# EAGLE schematic coilcube (EAGLE 6.3)

## Sheet 1 of 5: EPIC & Programmer
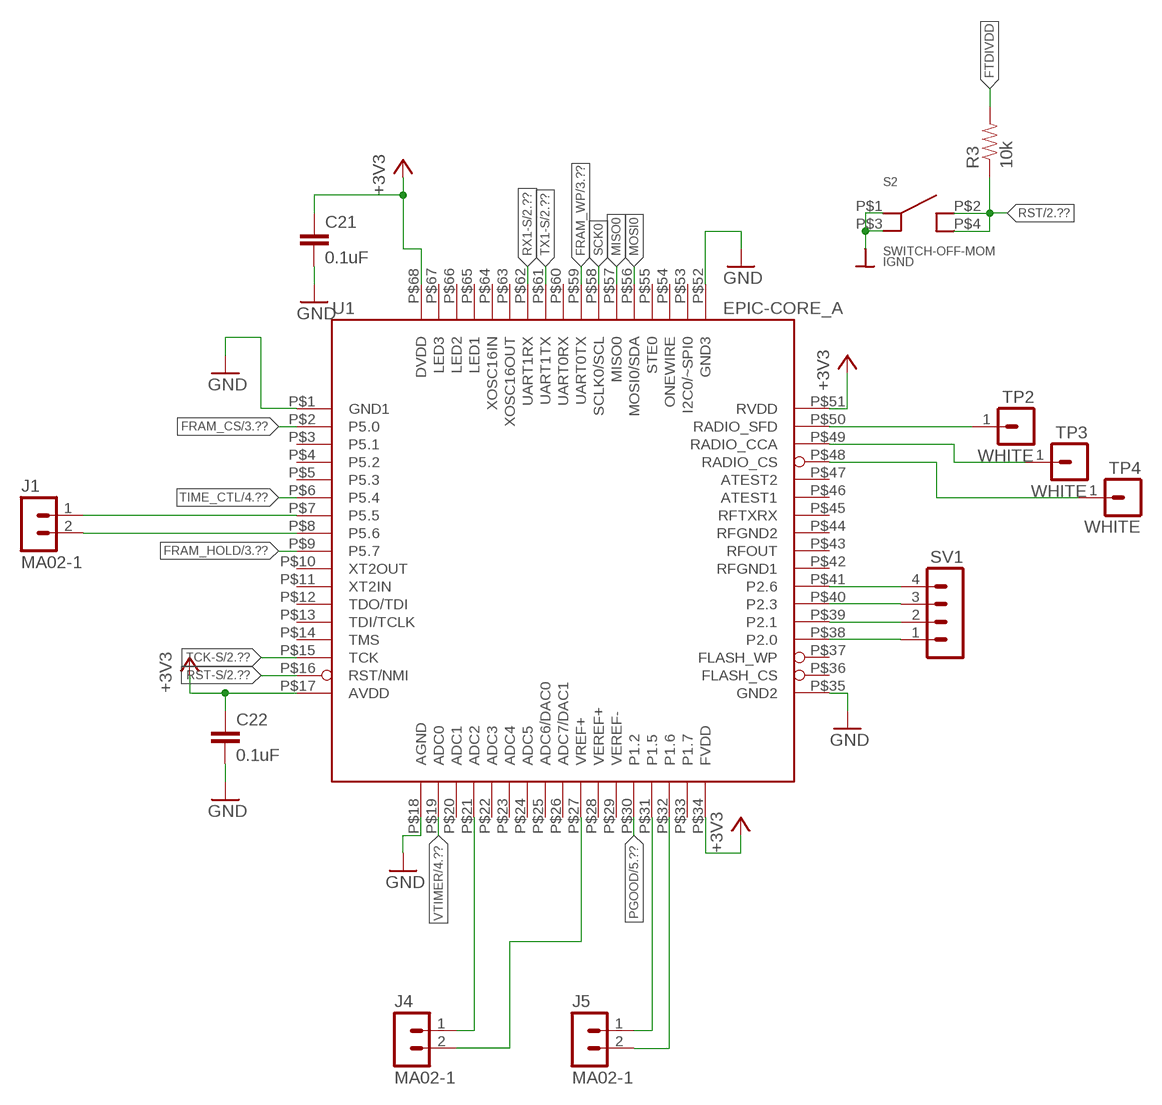
[diagram p0: schematic, sheet 1]

### Parts
C21  0.1uF  C-EUC0603  [C0603]
C22  0.1uF  C-EUC0603  [C0603]
J1  MA02-1  [MA02-1]
J4  MA02-1  [MA02-1]
J5  MA02-1  [MA02-1]
R3  10k  RESISTOR0603-RES  [0603-RES]
S2  SWITCH-OFF-MOM  [SWITCH-OFF-MOM]
SV1  MA04-1  [MA04-1]
TP2  WHITE  MA01-1  [MA01-1]
TP3  WHITE  MA01-1  [MA01-1]
TP4  WHITE  MA01-1  [MA01-1]
U1  EPIC-CORE_A  [EPIC-LCC68]

### Nets
+3V3: C21.1 C22.1 U1.P$17(AVDD) U1.P$34(FVDD) U1.P$51(RVDD) U1.P$68(DVDD) ; also sheet 2,3,4,5
FRAM_CS: U1.P$2(P5.0) ; also sheet 3
FRAM_HOLD: U1.P$9(P5.7) ; also sheet 3
FRAM_WP: U1.P$59(UART0TX) ; also sheet 3
FTDIVDD: R3.2 ; also sheet 2
GND: C21.2 C22.2 U1.P$1(GND1) U1.P$18(AGND) U1.P$35(GND2) U1.P$52(GND3) ; also sheet 2,3,4,5
IGND: S2.P$1(P1) S2.P$3(P3) ; also sheet 2
MISO0: U1.P$57(MISO0) ; also sheet 3
MOSI0: U1.P$56(MOSI0/SDA) ; also sheet 3
N$2: J5.1 U1.P$31(P1.5)
N$3: J5.2 U1.P$32(P1.6)
N$4: J4.1 U1.P$21(ADC2)
N$5: J4.2 U1.P$27(VREF+)
N$6: SV1.4 U1.P$41(P2.6)
N$7: SV1.3 U1.P$40(P2.3)
N$8: SV1.2 U1.P$39(P2.1)
N$9: SV1.1 U1.P$38(P2.0)
N$10: TP2.1 U1.P$50(RADIO_SFD)
N$13: TP3.1 U1.P$49(RADIO_CCA)
N$14: TP4.1 U1.P$48(RADIO_CS)
N$26: J1.1 U1.P$7(P5.5)
N$27: J1.2 U1.P$8(P5.6)
PGOOD: U1.P$30(P1.2) ; also sheet 5
RST: R3.1 S2.P$2(P2) S2.P$4(P4) ; also sheet 2
RST-S: U1.P$16(RST/NMI) ; also sheet 2
RX1-S: U1.P$62(UART1RX) ; also sheet 2
SCK0: U1.P$58(SCLK0/SCL) ; also sheet 3
TCK-S: U1.P$15(TCK) ; also sheet 2
TIME_CTL: U1.P$6(P5.4) ; also sheet 4
TX1-S: U1.P$61(UART1TX) ; also sheet 2
VTIMER: U1.P$19(ADC0) ; also sheet 4
Unconnected: U1.P$3(P5.1) U1.P$4(P5.2) U1.P$5(P5.3) U1.P$10(XT2OUT) U1.P$11(XT2IN) U1.P$12(TDO/TDI) U1.P$13(TDI/TCLK) U1.P$14(TMS) U1.P$20(ADC1) U1.P$22(ADC3) U1.P$23(ADC4) U1.P$24(ADC5) U1.P$25(ADC6/DAC0) U1.P$26(ADC7/DAC1) U1.P$28(VEREF+) U1.P$29(VEREF-) U1.P$33(P1.7) U1.P$36(FLASH_CS) U1.P$37(FLASH_WP) U1.P$42(RFGND1) U1.P$43(RFOUT) U1.P$44(RFGND2) U1.P$45(RFTXRX) U1.P$46(ATEST1) U1.P$47(ATEST2) U1.P$53(I2C0/~SPI0) U1.P$54(ONEWIRE) U1.P$55(STE0) U1.P$60(UART0RX) U1.P$63(XOSC16OUT) U1.P$64(XOSC16IN) U1.P$65(LED1) U1.P$66(LED2) U1.P$67(LED3)

## Sheet 2 of 5: Programmer
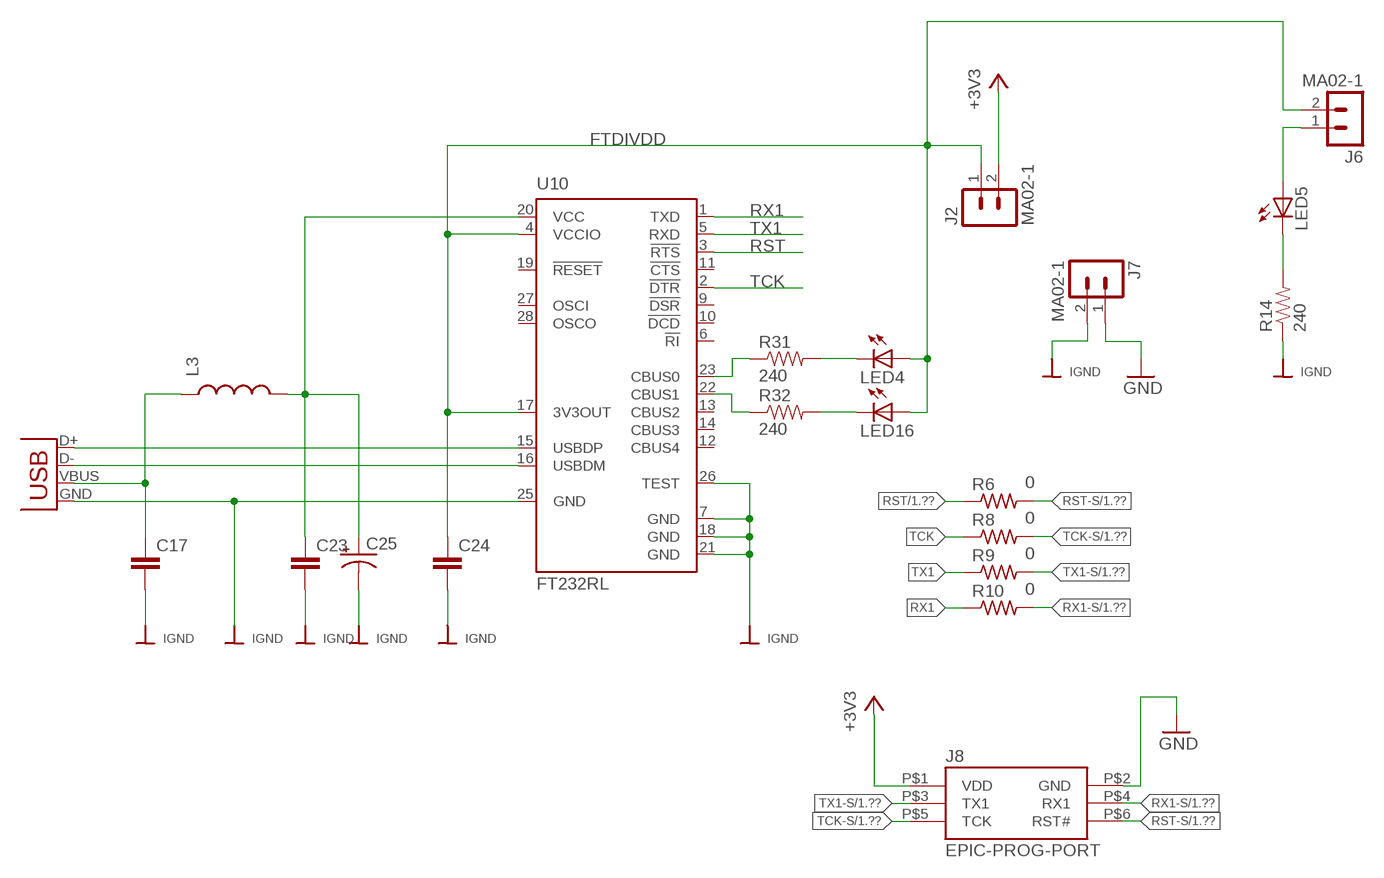
[diagram p1: schematic, sheet 2]

### Parts
C17  CAP0603-CAP  [0603-CAP]
C23  CAP0603-CAP  [0603-CAP]
C24  CAP0603-CAP  [0603-CAP]
C25  CAP_POL1206  [EIA3216]
J2  MA02-1  [MA02-1]
J6  MA02-1  [MA02-1]
J7  MA02-1  [MA02-1]
J8  EPIC-PROG-PORT  [HEADER2X3X2MM]
L3  INDUCTOR0603  [0603]
LED4  LED0603  [LED-0603]
LED5  LED0603  [LED-0603]
LED16  LED0603  [LED-0603]
R6  0  R-US_R0603  [R0603]
R8  0  R-US_R0603  [R0603]
R9  0  R-US_R0603  [R0603]
R10  0  R-US_R0603  [R0603]
R14  240  RESISTOR0603-RES  [0603-RES]
R31  240  RESISTOR0603-RES  [0603-RES]
R32  240  RESISTOR0603-RES  [0603-RES]
U10  FT232RL  [SSOP28]
X2  USBSMD  [USB-MINIB]

### Nets
+3V3: J2.2 J8.P$1(VDD) ; also sheet 1,3,4,5
FTDIVDD: C24.1 J2.1 J6.2 LED4.A LED16.A U10.4(VCCIO) U10.17(3V3OUT) ; also sheet 1
GND: J7.1 J8.P$2(GND) ; also sheet 1,3,4,5
IGND: C17.2 C23.2 C24.2 C25.C(-) J7.2 R14.1 U10.7(GND) U10.18(GND) U10.21(GND) U10.25(GND) U10.26(TEST) X2.GND ; also sheet 1
N$11: J6.1 LED5.A
N$32: LED5.C R14.2
N$38: U10.15(USBDP) X2.D+
N$39: U10.16(USBDM) X2.D-
N$40: LED4.C R31.2
N$41: LED16.C R32.2
N$42: R31.1 U10.23(CBUS0)
N$43: R32.1 U10.22(CBUS1)
RST: R6.1 U10.3(!RTS) ; also sheet 1
RST-S: J8.P$6(RST#) R6.2 ; also sheet 1
RX1: R10.1 U10.1(TXD)
RX1-S: J8.P$4(RX1) R10.2 ; also sheet 1
TCK: R8.1 U10.2(!DTR)
TCK-S: J8.P$5(TCK) R8.2 ; also sheet 1
TX1: R9.1 U10.5(RXD)
TX1-S: J8.P$3(TX1) R9.2 ; also sheet 1
USBVCC1: C23.1 C25.A(+) L3.2 U10.20(VCC)
VBUS1: C17.1 L3.1 X2.VBUS
Unconnected: U10.6(!RI) U10.9(!DSR) U10.10(!DCD) U10.11(!CTS) U10.12(CBUS4) U10.13(CBUS2) U10.14(CBUS3) U10.19(!RESET) U10.27(OSCI) U10.28(OSCO)

## Sheet 3 of 5: FRAM
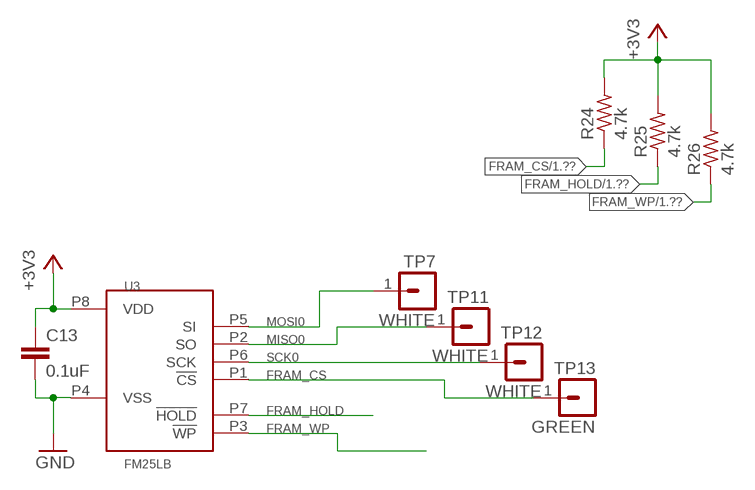
[diagram p2: schematic, sheet 3]

### Parts
C13  0.1uF  C-EUC0603  [C0603]
R24  4.7k  R-US_R0603  [R0603]
R25  4.7k  R-US_R0603  [R0603]
R26  4.7k  R-US_R0603  [R0603]
TP7  WHITE  MA01-1  [MA01-1]
TP11  WHITE  MA01-1  [MA01-1]
TP12  WHITE  MA01-1  [MA01-1]
TP13  GREEN  MA01-1  [MA01-1]
U3  FM25LB  [SOIC_8]

### Nets
+3V3: C13.1 R24.2 R25.2 R26.2 U3.P8(VDD) ; also sheet 1,2,4,5
FRAM_CS: R24.1 TP13.1 U3.P1(!CS) ; also sheet 1
FRAM_HOLD: R25.1 U3.P7(!HOLD) ; also sheet 1
FRAM_WP: R26.1 U3.P3(!WP) ; also sheet 1
GND: C13.2 U3.P4(VSS) ; also sheet 1,2,4,5
MISO0: TP11.1 U3.P2(SO) ; also sheet 1
MOSI0: TP7.1 U3.P5(SI) ; also sheet 1
SCK0: TP12.1 U3.P6(SCK) ; also sheet 1

## Sheet 4 of 5: Time Keeping
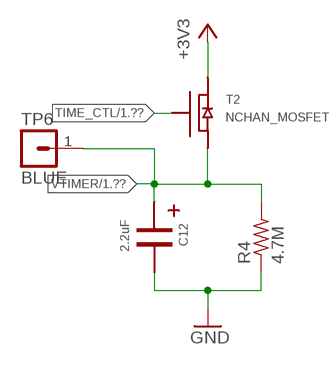
[diagram p3: schematic, sheet 4]

### Parts
C12  2.2uF  CAP_POLEA1MM5  [CPOL_EEA_1MM5]
R4  4.7M  R-US_R0805  [R0805]
T2  NCHAN_MOSFET  [NCHAN_MOSFET]
TP6  BLUE  MA01-1  [MA01-1]

### Nets
+3V3: T2.D ; also sheet 1,2,3,5
GND: C12.- R4.1 ; also sheet 1,2,3,5
TIME_CTL: T2.G ; also sheet 1
VTIMER: C12.+ R4.2 T2.S TP6.1 ; also sheet 1

## Sheet 5 of 5: Power Supply
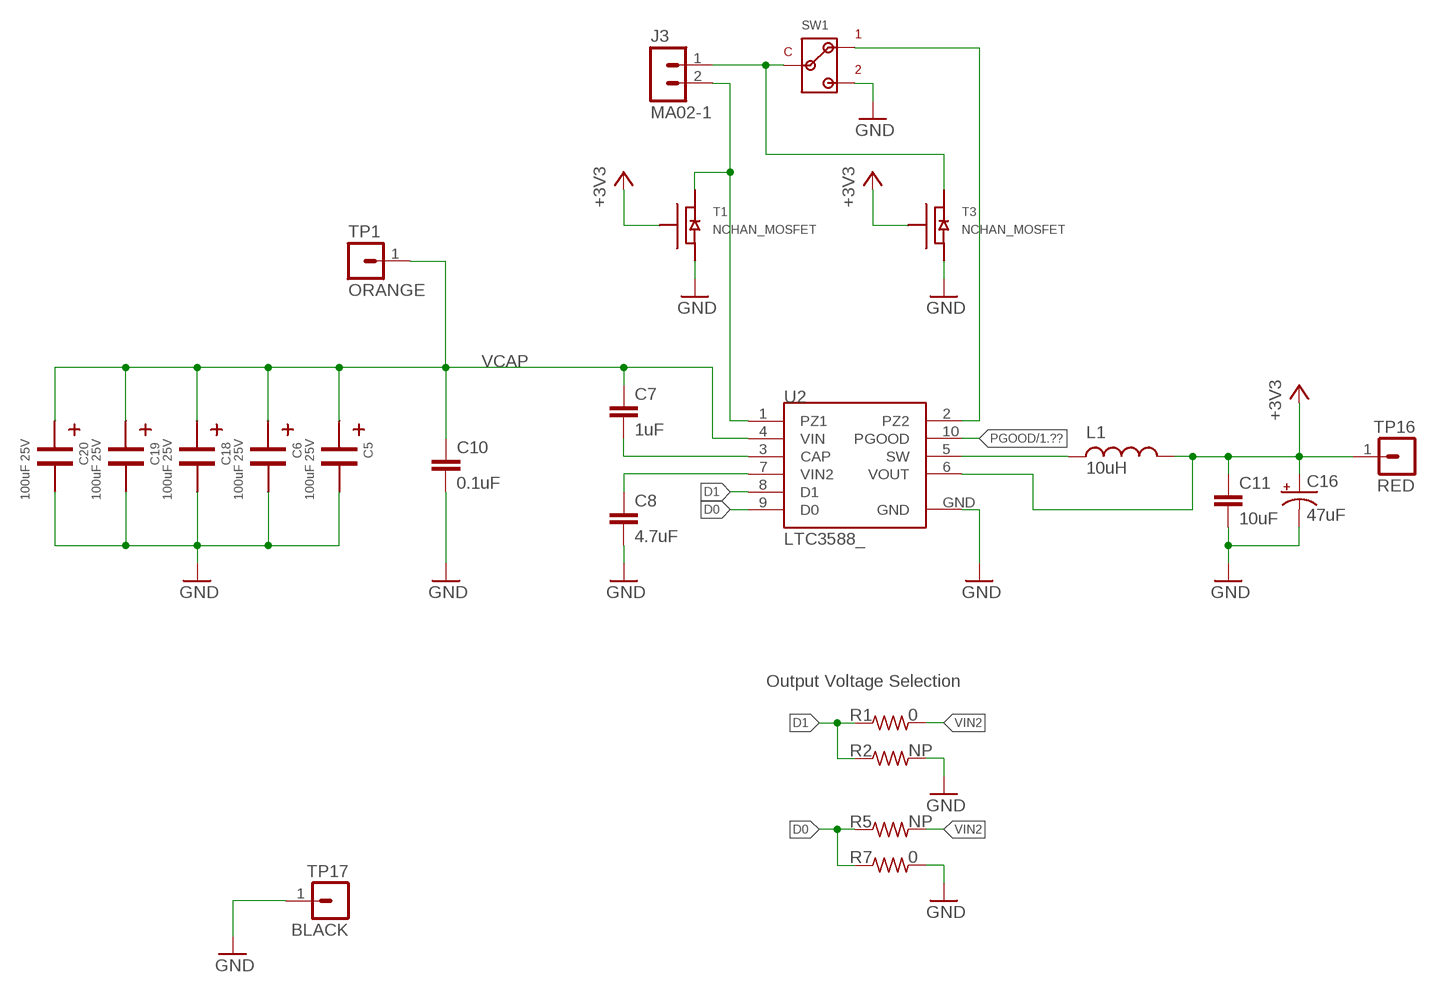
[diagram p4: schematic, sheet 5]

### Parts
C5  100uF 25V  2917_CAP_POL  [2917_CAP_POL]
C6  100uF 25V  2917_CAP_POL  [2917_CAP_POL]
C7  1uF  C-EUC0603  [C0603]
C8  4.7uF  C-EUC0603  [C0603]
C10  0.1uF  C-EUC0603  [C0603]
C11  10uF  C-EUC1206  [C1206]
C16  47uF  CAP_POL1206  [EIA3216]
C18  100uF 25V  2917_CAP_POL  [2917_CAP_POL]
C19  100uF 25V  2917_CAP_POL  [2917_CAP_POL]
C20  100uF 25V  2917_CAP_POL  [2917_CAP_POL]
J3  MA02-1  [MA02-1]
L1  10uH  INDUCTOR1210  [1210]
R1  0  R-US_R0603  [R0603]
R2  NP  R-US_R0603  [R0603]
R5  NP  R-US_R0603  [R0603]
R7  0  R-US_R0603  [R0603]
SW1  SWITCH_SPDP  [SWITCH_SPDP]
T1  NCHAN_MOSFET  [NCHAN_MOSFET]
T3  NCHAN_MOSFET  [NCHAN_MOSFET]
TP1  ORANGE  MA01-1  [MA01-1]
TP16  RED  MA01-1  [MA01-1]
TP17  BLACK  MA01-1  [MA01-1]
U2  LTC3588_  [MSOP-10-GNDPAD]

### Nets
+3V3: C11.1 C16.A(+) L1.2 T1.G T3.G TP16.1 U2.6(VOUT) ; also sheet 1,2,3,4
D0: R5.1 R7.1 U2.9(D0)
D1: R1.1 R2.1 U2.8(D1)
GND: C5.- C6.- C8.2 C10.2 C11.2 C16.C(-) C18.- C19.- C20.- R2.2 R7.2 SW1.P3(P2) T1.S T3.S TP17.1 U2.GND ; also sheet 1,2,3,4
N$1: J3.1 SW1.P2(PC) T3.D
N$20: L1.1 U2.5(SW)
N$22: C7.2 U2.3(CAP)
PGOOD: U2.10(PGOOD) ; also sheet 1
PZ1: J3.2 T1.D U2.1(PZ1)
PZ2: SW1.P1 U2.2(PZ2)
VCAP: C5.+ C6.+ C7.1 C10.1 C18.+ C19.+ C20.+ TP1.1 U2.4(VIN)
VIN2: C8.1 R1.2 R5.2 U2.7(VIN2)

### Notes on the sheet
- Output Voltage Selection

## Library data of the parts
C5 C6 C18-C20 = coilcube:2917_CAP_POL; DIGIKEY: 399-5175-1-ND
C7 = rcl:C-EU: CAPACITOR, European symbol; DIGIKEY: 445-1321-1-ND
C8 = rcl:C-EU: CAPACITOR, European symbol; DIGIKEY: 445-5178-1-ND
C10 C13 C21 C22 = rcl:C-EU: CAPACITOR, European symbol; DIGIKEY: 445-1316-1-ND
C11 = rcl:C-EU: CAPACITOR, European symbol; DIGIKEY: 399-8152-1-ND
C12 = coilcube:CAP_POL; DIGIKEY: P14506-ND
C16 = SparkFun-Passives:CAP_POL: Capacitor Polarized These are standard SMD and PTH capacitors. Normally 10uF, 47uF, and 100uF in electrolytic and tantalum varieties. Always verify the external diameter of the through hole cap, it varies with capacity, voltage, and manufacturer. The EIA devices should be standard.; DIGIKEY: 399-3700-1-ND
C17 C23 C24 = SparkFun:CAP: Capacitor Standard 0603 ceramic capacitor, and 0.1" leaded capacitor.; DIGIKEY: 445-1316-1-ND
C25 = SparkFun:CAP_POL: Capacitor Polarized These are standard SMD and PTH capacitors. Normally 10uF, 47uF, and 100uF in electrolytic and tantalum varieties. Always verify the external diameter of the through hole cap, it varies with capacity, voltage, and manufacturer. The EIA devices should be standard.; DIGIKEY: 478-1655-1-ND
J1 J2 J4 J6 J7 = con-lstb:MA02-1; DIGIKEY: 609-4434-ND
J3 = con-lstb:MA02-1; DIGIKEY: A98333-ND
J5 = con-lstb:MA02-1; DIGIEKY: 609-4434-ND
J8 = berkeley-epic:EPIC-PROG-PORT; DIGIKEY: WM18834-ND
L1 = SparkFun-Passives:INDUCTOR: Inductors Basic Inductor/Choke - 0603 and 1206. Footprints are not proven and vary greatly between part numbers.; DIGIKEY: 587-1625-1-ND
L3 = SparkFun:INDUCTOR: Inductors Basic Inductor/Choke - 0603 and 1206. Footprints are not proven and vary greatly between part numbers.; DIGIKEY: 240-2373-1-ND
LED4 = SparkFun:LED: LEDs Standard schematic elements and footprints for 5mm, 3mm, 1206, and 0603 sized LEDs. 5mm - Spark Fun Electronics SKU : COM-00529 (and others); DIGIKEY: 1080-1400-1-ND
LED5 LED16 = SparkFun:LED: LEDs Standard schematic elements and footprints for 5mm, 3mm, 1206, and 0603 sized LEDs. 5mm - Spark Fun Electronics SKU : COM-00529 (and others); DIGIKEY: 1080-1405-1-ND
R1 R6-R10 = rcl:R-US_: RESISTOR, American symbol; DIGIKEY: P0.0GCT-ND
R2 R5 = rcl:R-US_: RESISTOR, American symbol
R3 = SparkFun:RESISTOR: Resistor Basic schematic elements and footprints for 0603, 1206, and PTH 1/10th watt (small) resistors.; DIGIKEY: P10KGCT-ND
R4 = rcl:R-US_: RESISTOR, American symbol; DIGIKEY: P4.7MACT-ND
R14 R31 R32 = SparkFun:RESISTOR: Resistor Basic schematic elements and footprints for 0603, 1206, and PTH 1/10th watt (small) resistors.; DIGIKEY: P240GCT-ND
R24-R26 = rcl:R-US_: RESISTOR, American symbol; DIGIKEY: P4.7KGCT-ND
S2 = p498:SWITCH-OFF-MOM; DIGIKEY: P11084SCT-ND
SV1 = con-lstb:MA04-1: PIN HEADER; DIGIKEY: 609-3248-ND; OC_FARNELL: unknown; OC_NEWARK: unknown
SW1 = coilcube:SWITCH_SPDP; DIGIKEY: 563-1022-1-ND
T1 T3 = Power_Metering:NCHAN_MOSFET; DIGIKEY: SI1302DL-T1-GE3CT-ND
T2 = Power_Metering:NCHAN_MOSFET; DIGIKEY: 568-3244-1-ND
TP1 = con-lstb:MA01-1; DIGIKEY: 5003K-ND
TP2-TP4 TP7 TP11 TP12 = con-lstb:MA01-1; DIGIKEY: 5002K-ND
TP6 = con-lstb:MA01-1; DIGIKEY: 5117K-ND
TP13 = con-lstb:MA01-1; DIGIKEY: 5116K-ND
TP16 = con-lstb:MA01-1; DIGIKEY: 5000K-ND
TP17 = con-lstb:MA01-1; DIGIKEY: 5001K-ND
U1 = berkeley-epic:EPIC-CORE_A
U2 = SparkFun-PowerIC:LTC3588: Energy Harvesting Power Supply; DIGIKEY: LTC3588EMSE-1#PBF-ND
U3 = coilcube:FM25LB; DIGIKEY: 428-3210-ND
U10 = ftdichip:FT232R: Source: http://www.ftdichip.com/Documents/DataSheets/DS_FT232R_v104.pdf; DIGIKEY: 768-1007-1-ND; MPN: FT232RL; OC_FARNELL: 1146032; OC_NEWARK: 91K9918
X2 = SparkFun:USB: USB Connectors USB-B-PTH is fully proven SKU : PRT-00139 USB-miniB is fully proven SKU : PRT-00587 USB-A-PCB is untested. USB-A-H is throughly reviewed, but untested. Spark Fun Electronics SKU : PRT-00437 USB-B-SMT is throughly reviewed, but untested. Needs silkscreen touching up. USB-A-S has not been used/tested USB-MB-H has not been used/tested; DIGIKEY: 670-1190-1-ND